# Altium project SpeedGateControl.PrjPcb (part 2 of 2)

## Sheet 06_LED_OUTPUTS.SchDoc
size A3
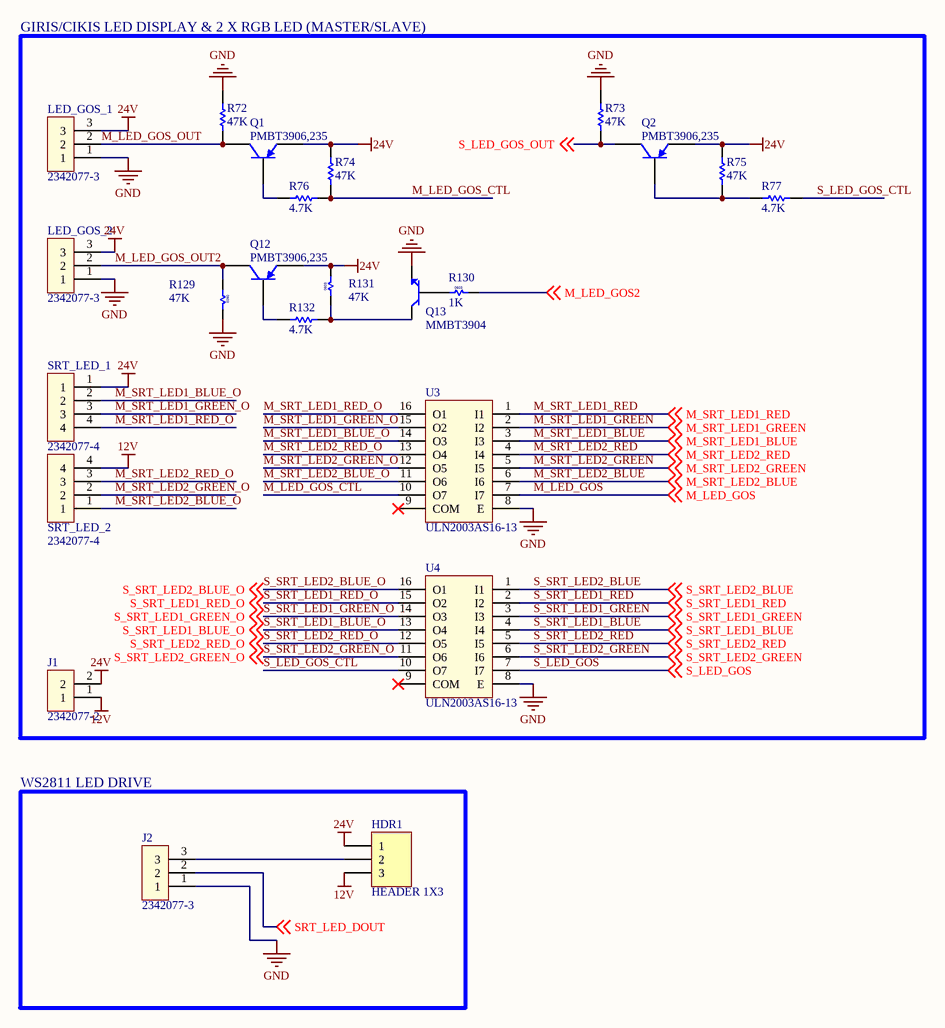
[diagram p5: 06_LED_OUTPUTS.SchDoc]

### Parts
HDR1  HEADER 1X3  [HDR1X3]
J1  2342077-2  [TERM BLOCK HDR 2POS 90DEG PITCH 3.81MM]
J2  2342077-3  [TERM BLOCK HDR 3POS 90DEG PITCH 3.81MM]
LED_GOS_1  2342077-3  [TERM BLOCK HDR 3POS 90DEG PITCH 3.81MM]
LED_GOS_2  2342077-3  [TERM BLOCK HDR 3POS 90DEG PITCH 3.81MM]
Q1  PMBT3906,235  [ONSC-SOT-23-3-318-08_V]
Q2  PMBT3906,235  [ONSC-SOT-23-3-318-08_V]
Q12  PMBT3906,235  [ONSC-SOT-23-3-318-08_V]
Q13  MMBT3904  [ONSC-SOT-23-3-318-08_V]
R72  47K  [603R]
R73  47K  [603R]
R74  47K  [603R]
R75  47K  [603R]
R76  4.7K  [603R]
R77  4.7K  [603R]
R129  47K  [603R]
R130  1K  [603R]
R131  47K  [603R]
R132  4.7K  [603R]
SRT_LED_1  2342077-4  [TERM BLOCK HDR 4POS 90DEG PITCH 3.81MM]
SRT_LED_2  2342077-4  [TERM BLOCK HDR 4POS 90DEG PITCH 3.81MM]
U3  ULN2003AS16-13  [SO16]
U4  ULN2003AS16-13  [SO16]

### Blocks framed on the sheet
GIRIS/CIKIS LED DISPLAY & 2 X RGB LED (MASTER/SLAVE): J1 LED_GOS_1 LED_GOS_2 Q1 Q2 Q12 Q13 R72-R77 R129-R132 SRT_LED_1 SRT_LED_2 U3 U4
WS2811 LED DRIVE: HDR1 J2

### Nets
12V: HDR1.3 J1.1 SRT_LED_2.4
24V: HDR1.1 J1.2 LED_GOS_1.3 LED_GOS_2.3 Q1.2(E) Q2.2(E) Q12.2(E) R74.2 R75.2 R131.2 SRT_LED_1.1
GND: J2.1 LED_GOS_1.1 LED_GOS_2.1 Q13.2(E) R72.1 R73.1 R129.2 U3.8(E) U4.8(E)
M_LED_GOS: U3.7(I7) ; off-sheet M_LED_GOS
M_LED_GOS2: R130.2 ; off-sheet M_LED_GOS2
M_LED_GOS_CTL: R74.1 R76.1 U3.10(O7)
M_LED_GOS_OUT: LED_GOS_1.2 Q1.3(C) R72.2
M_LED_GOS_OUT2: LED_GOS_2.2 Q12.3(C) R129.1
M_SRT_LED1_BLUE: U3.3(I3) ; off-sheet M_SRT_LED1_BLUE
M_SRT_LED1_BLUE_O: SRT_LED_1.2 U3.14(O3)
M_SRT_LED1_GREEN: U3.2(I2) ; off-sheet M_SRT_LED1_GREEN
M_SRT_LED1_GREEN_O: SRT_LED_1.3 U3.15(O2)
M_SRT_LED1_RED: U3.1(I1) ; off-sheet M_SRT_LED1_RED
M_SRT_LED1_RED_O: SRT_LED_1.4 U3.16(O1)
M_SRT_LED2_BLUE: U3.6(I6) ; off-sheet M_SRT_LED2_BLUE
M_SRT_LED2_BLUE_O: SRT_LED_2.1 U3.11(O6)
M_SRT_LED2_GREEN: U3.5(I5) ; off-sheet M_SRT_LED2_GREEN
M_SRT_LED2_GREEN_O: SRT_LED_2.2 U3.12(O5)
M_SRT_LED2_RED: U3.4(I4) ; off-sheet M_SRT_LED2_RED
M_SRT_LED2_RED_O: SRT_LED_2.3 U3.13(O4)
S_LED_GOS: U4.7(I7) ; off-sheet S_LED_GOS
S_LED_GOS_CTL: R77.1 U4.10(O7)
S_LED_GOS_OUT: Q2.3(C) R73.2 ; off-sheet S_LED_GOS_OUT
S_SRT_LED1_BLUE: U4.4(I4) ; off-sheet S_SRT_LED1_BLUE
S_SRT_LED1_BLUE_O: U4.13(O4) ; off-sheet S_SRT_LED1_BLUE_O
S_SRT_LED1_GREEN: U4.3(I3) ; off-sheet S_SRT_LED1_GREEN
S_SRT_LED1_GREEN_O: U4.14(O3) ; off-sheet S_SRT_LED1_GREEN_O
S_SRT_LED1_RED: U4.2(I2) ; off-sheet S_SRT_LED1_RED
S_SRT_LED1_RED_O: U4.15(O2) ; off-sheet S_SRT_LED1_RED_O
S_SRT_LED2_BLUE: U4.1(I1) ; off-sheet S_SRT_LED2_BLUE
S_SRT_LED2_BLUE_O: U4.16(O1) ; off-sheet S_SRT_LED2_BLUE_O
S_SRT_LED2_GREEN: U4.6(I6) ; off-sheet S_SRT_LED2_GREEN
S_SRT_LED2_GREEN_O: U4.11(O6) ; off-sheet S_SRT_LED2_GREEN_O
S_SRT_LED2_RED: U4.5(I5) ; off-sheet S_SRT_LED2_RED
S_SRT_LED2_RED_O: U4.12(O5) ; off-sheet S_SRT_LED2_RED_O
SRT_LED_DOUT: J2.2 ; off-sheet SRT_LED_DOUT
NetHDR1_2: HDR1.2 J2.3
NetQ1_1: Q1.1(B) R76.2
NetQ2_1: Q2.1(B) R75.1 R77.2
NetQ12_1: Q12.1(B) R132.2
NetQ13_1: Q13.1(B) R130.1
NetQ13_3: Q13.3(C) R131.1 R132.1

Not connected (* = marked no-connect by the designer): U3 9(COM)*; U4 9(COM)*

### Notes on the sheet
- (in symbol RES_1K_OHM_%5_0.1W_0603) 0603
- (in symbol RES_47K_OHM_%5_0.1W_0603) 0603

### Library data of the parts
HDR1 = HEADER 1X3: Header, 3-Pin; LatestRevisionDate: 17-Jul-2002; LatestRevisionNote: Re-released for DXP Platform.; Publisher: Altium Limited
J1 = TERM BLOCK HDR 2POS 90DEG 3.81MM: as 24V_IN on sheet 01_POWER; Digi-Key Part Number: A145321-ND; Value: 2342077-2; Pitch: 0.150" (3.81mm); Header Orientation: 90°, Right Angle; Insulation Height: 0.285" (7.25mm)
J2 LED_GOS_1 LED_GOS_2 = TERM BLOCK HDR 3POS 90DEG 3.81MM: 3 Position Terminal Block Header, Male Pins, Shrouded (4 Side) 0.150" (3.81mm) 90°, Right Angle - Through Hole; Manufacturer: TE Connectivity AMP Connectors; Contact Tail Length: 0.075" (1.90mm); Digi-Key Part Number: A145322-ND; Value: 2342077-3; Pitch: 0.150" (3.81mm); Header Orientation: 90°, Right Angle; Insulation Height: 0.285" (7.25mm)
Q1 Q2 Q12 = TRANS PNP 40V 200MA TO236AB PMBT3906_235: Bipolar (BJT) Transistor PNP 40 V 200 mA 250MHz 250 mW Surface Mount TO-236AB; DC Current Gain (hFE) (Min) @ Ic, Vce: 100 @ 10mA, 1V; Power - Max: 250 mW; Vce Saturation (Max) @ Ib, Ic: 400mV @ 5mA, 50mA; Voltage - Collector Emitter Breakdown (Max): 40 V; Current - Collector (Ic) (Max): 200 mA; Package / Case: TO-236-3, SC-59, SOT-23-3; Operating Temperature: 150°C (TJ); Transistor Type: PNP; Value: PMBT3906,235; Digi-Key Part Number: 1727-1885-1-ND
Q13 = NPN_BT3904: Bipolar (BJT) Transistor NPN 40V 200mA 300MHz 300mW Surface Mount SOT-23-3 (TO-236); Manufacturer: ON Semiconductor; Manufacturer Part Number: MMBT3904LT3G; MAX  Voltage / Current: 40V /200mA; DC Current Gain (hFE) (Min) @ Ic, Vce: 100 @ 10mA, 1V; Vce Saturation (Max) @ Ib, Ic: 300mV @ 5mA, 50mA; value: MMBT3904; Digi-Key Part Number: MMBT3904LT3GOSTR-ND; Package / Case: TO-236-3, SC-59, SOT-23-3; Power - Max: 300mW; Frequency - Transition: 300MHz; Transistor Type: NPN; Current - Collector (Ic) (Max): 200mA; Voltage - Collector Emitter Breakdown (Max): 40V; Operating Temperature: -55°C ~ 150°C (TJ); Supplier Device Package: SOT-23-3 (TO-236)
R72-R75 = RES SMD 47K OHM 1% 1/10W 0603: 47 kOhms ±1% 0.1W, 1/10W Chip Resistor 0603 (1608 Metric)  Thick Film; Manufacturer: Yageo; Manufacturer Part Number: RC0603FR-0747KL; Temperature Coefficient: ±100ppm/°C; Value: 47K; Digi-Key Part Number: 311-47.0KHRCT-ND; Tolerance: ±1%; Power (Watts): 0.1W, 1/10W; Composition: Thick Film; Operating Temperature: -55°C ~ 155°C; Package / Case: 0603 (1608 Metric); Size / Dimension: 0.063" L x 0.032" W (1.60mm x 0.80mm); Height - Seated (Max): 0.022" (0.55mm)
R76 R77 R132 = RES_4.7K_OHM_%5_0.1W_0603: as R6 on sheet 03_PHOTOELECTRIC_SENSOR; Value: 4.7K; Digi-Key Part Number: 311-4.7KGRTR-ND; Tolerance: ±5%; Power (Watts): 0.1W, 1/10W; Composition: Thick Film; Operating Temperature: -55°C ~ 155°C; Package / Case: 0603 (1608 Metric); Size / Dimension: 0.063" L x 0.032" W (1.60mm x 0.80mm); Height - Seated (Max): 0.022" (0.55mm); Features: Moisture Resistant
R129 R131 = RES_47K_OHM_%5_0.1W_0603: 47 kOhms ±5% 0.1W, 1/10W Chip Resistor 0603 (1608 Metric) Moisture Resistant Thick Film; Manufacturer: Yageo; Manufacturer Part Number: RC0603JR-0747KL; Temperature Coefficient: ±100ppm/°C; Value: 47K; Digi-Key Part Number: 311-47KGRTR-ND; Tolerance: ±5%; Power (Watts): 0.1W, 1/10W; Composition: Thick Film; Operating Temperature: -55°C ~ 155°C; Package / Case: 0603 (1608 Metric); Size / Dimension: 0.063" L x 0.032" W (1.60mm x 0.80mm); Height - Seated (Max): 0.022" (0.55mm); Features: Moisture Resistant
R130 = RES_1K_OHM_%5_0.1W_0603: 1 kOhms ±5% 0.1W, 1/10W Chip Resistor 0603 (1608 Metric) Moisture Resistant Thick Film; Manufacturer: Yageo; Manufacturer Part Number: RC0603JR-071KL; Temperature Coefficient: ±100ppm/°C; Value: 1K; Digi-Key Part Number: 311-1.0KGRTR-ND; Tolerance: ±5%; Power (Watts): 0.1W, 1/10W; Composition: Thick Film; Operating Temperature: -55°C ~ 155°C; Package / Case: 0603 (1608 Metric); Size / Dimension: 0.063" L x 0.032" W (1.60mm x 0.80mm); Height - Seated (Max): 0.022" (0.55mm); Features: Moisture Resistant
SRT_LED_1 SRT_LED_2 = TERM BLOCK HDR 4POS 90DEG 3.81MM: 4 Position Terminal Block Header, Male Pins, Shrouded (4 Side) 0.150" (3.81mm) 90°, Right Angle - Through Hole; Manufacturer: TE Connectivity AMP Connectors; Contact Tail Length: 0.075" (1.90mm); Digi-Key Part Number: A145323-ND; Value: 2342077-4; Pitch: 0.150" (3.81mm); Header Orientation: 90°, Right Angle; Insulation Height: 0.285" (7.25mm)
U3 U4 = IC PWR RELAY 7NPN 1:1 16SO ULN2003AS16-13: Bipolar (BJT) Transistor Array 7 NPN Darlington 50V 500mA - - Surface Mount 16-SO; Manufacturer: Diodes Incorporated; Current - Supply: 285µA; Vce Saturation (Max) @ Ib, Ic: 1.6V @ 500µA, 350mA; Digi-Key Part Number: ULN2003AS16-13DICT-ND; Value: ULN2003AS16-13; Operating Temperature: -40°C ~ 105°C (TA); Transistor Type: 7 NPN Darlington; Current - Collector (Ic) (Max): 500mA; Package / Case: 16-SOIC (0.154", 3.90mm Width); Voltage - Collector Emitter Breakdown (Max): 50V

## Sheet 07_MOTOR_DRIVER_INTERFACE.SchDoc
size A4
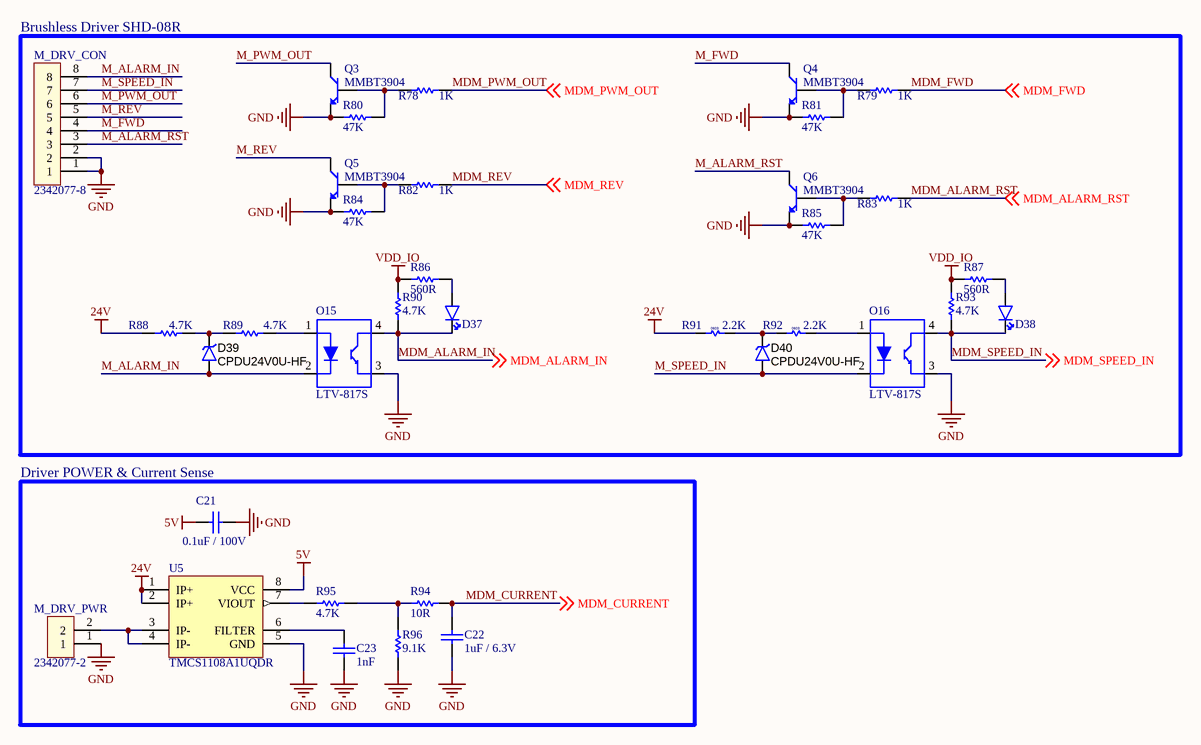
[diagram p6: 07_MOTOR_DRIVER_INTERFACE.SchDoc]

### Parts
C21  0.1uF / 100V  [603C]
C22  1uF / 6.3V  [603C]
C23  1nF  [603C]
D37  led_green  [805LED]  (value not drawn)
D38  led_green  [805LED]  (value not drawn)
D39  CPDU24V0U-HF  [SOD523F]
D40  CPDU24V0U-HF  [SOD523F]
M_DRV_CON  2342077-8  [TERM BLOCK HDR 8POS 90DEG PITCH 3.81MM]
M_DRV_PWR  2342077-2  [TERM BLOCK HDR 2POS 90DEG PITCH 3.81MM]
O15  LTV-817S  [SMD4-2.54-4.6X6.5MM]
O16  LTV-817S  [SMD4-2.54-4.6X6.5MM]
Q3  MMBT3904  [ONSC-SOT-23-3-318-08_V]
Q4  MMBT3904  [ONSC-SOT-23-3-318-08_V]
Q5  MMBT3904  [ONSC-SOT-23-3-318-08_V]
Q6  MMBT3904  [ONSC-SOT-23-3-318-08_V]
R78  1K  [603R]
R79  1K  [603R]
R80  47K  [603R]
R81  47K  [603R]
R82  1K  [603R]
R83  1K  [603R]
R84  47K  [603R]
R85  47K  [603R]
R86  560R  [603R]
R87  560R  [603R]
R88  4.7K  [603R]
R89  4.7K  [603R]
R90  4.7K  [603R]
R91  2.2K  [603R]
R92  2.2K  [603R]
R93  4.7K  [603R]
R94  10R  [603R]
R95  4.7K  [603R]
R96  9.1K  [603R]
U5  TMCS1108A1UQDR  [ACS712]

### Blocks framed on the sheet
Brushless Driver SHD-08R: D37-D40 M_DRV_CON O15 O16 Q3-Q6 R78-R93
Driver POWER & Current Sense: C21-C23 M_DRV_PWR R94-R96 U5

### Nets
5V: C21.1 R86.2 R87.2 R90.2 R93.2 U5.8(VCC)  [also labelled VDD_IO]
24V: R88.1 R91.1 U5.1(IP+) U5.2(IP+)
GND: C21.2 C22.1 C23.1 M_DRV_CON.1 M_DRV_CON.2 M_DRV_PWR.1 O15.3(EMITER) O16.3(EMITER) Q3.2(E) Q4.2(E) Q5.2(E) Q6.2(E) R80.1 R81.1 R84.1 R85.1 R96.1 U5.5(GND)
M_ALARM_IN: D39.1 M_DRV_CON.8 O15.2(CATHODE)
M_ALARM_RST: M_DRV_CON.3 Q6.3(C)
M_FWD: M_DRV_CON.4 Q4.3(C)
M_PWM_OUT: M_DRV_CON.6 Q3.3(C)
M_REV: M_DRV_CON.5 Q5.3(C)
M_SPEED_IN: D40.1 M_DRV_CON.7 O16.2(CATHODE)
MDM_ALARM_IN: D37.2(K) O15.4(COLLECTOR) R90.1 ; off-sheet MDM_ALARM_IN
MDM_ALARM_RST: R83.2 ; off-sheet MDM_ALARM_RST
MDM_CURRENT: C22.2 R94.2 ; off-sheet MDM_CURRENT
MDM_FWD: R79.2 ; off-sheet MDM_FWD
MDM_PWM_OUT: R78.2 ; off-sheet MDM_PWM_OUT
MDM_REV: R82.2 ; off-sheet MDM_REV
MDM_SPEED_IN: D38.2(K) O16.4(COLLECTOR) R93.1 ; off-sheet MDM_SPEED_IN
NetC23_2: C23.2 U5.6(FILTER)
NetD37_1: D37.1(A) R86.1
NetD38_1: D38.1(A) R87.1
NetD39_2: D39.2 R88.2 R89.1
NetD40_2: D40.2 R91.2 R92.1
NetM_DRV_PWR_2: M_DRV_PWR.2 U5.3(IP-) U5.4(IP-)
NetO15_1: O15.1(ANODE) R89.2
NetO16_1: O16.1(ANODE) R92.2
NetQ3_1: Q3.1(B) R78.1 R80.2
NetQ4_1: Q4.1(B) R79.1 R81.2
NetQ5_1: Q5.1(B) R82.1 R84.2
NetQ6_1: Q6.1(B) R83.1 R85.2
NetR94_1: R94.1 R95.1 R96.2
NetR95_2: R95.2 U5.7(VIOUT)

### Notes on the sheet
- (in symbol RES 2.2K OHM 5% 1/10W 0603) 0603

### Library data of the parts
C21 = CAP CER 0.1UF 100V X7R 0603: as C4 on sheet 01_POWER; Value: 0.1uF / 100V; Digi-Key Part Number: 2679-C0603X7R101-104KNPTR-ND; Tolerance: ±10%; Voltage - Rated: 100V; Temperature Coefficient: X7R; Operating Temperature: -55°C ~ 125°C; Applications: General Purpose; Package / Case: 0603 (1608 Metric)
C22 = CAP_CER 1UF 6.3V X5R 0603: 1µF ±10% 6.3V Ceramic Capacitor X5R 0603 (1608 Metric); Manufacturer: Samsung Electro-Mechanics; Manufacturer Part Number: CL10A105KQ8NNNC; Value: 1uF / 6.3V; Digi-Key Part Number: 1276-1036-1-ND; Tolerance: ±10%; Voltage - Rated: 6.3V; Temperature Coefficient: X5R; Operating Temperature: -55°C ~ 85°C; Applications: General Purpose; Package / Case: 0603 (1608 Metric)
C23 = CAP_CER_1nF_50V_%5_ X7R_ 0603: 1nF ±5% 50V Ceramic Capacitor X7R 0603 (1608 Metric); Manufacturer: Yageo; Manufacturer Part Number: CC0603JRX7R9BB102; Value: 1nF; Digi-Key Part Number: 311-3361-2-ND; Tolerance: ±5%; Voltage - Rated: 50V; Temperature Coefficient: X7R; Operating Temperature: -55°C ~ 125°C; Applications: General Purpose; Package / Case: 0603 (1608 Metric); Size / Dimension: 0.063" L x 0.032" W (1.60mm x 0.80mm); Thickness (Max): 0.035" (0.90mm)
D37 D38 = LED_GREEN_0805: as D46 on sheet 02_CPU; value: led_green; Digi-Key Part Number: 754-1127-1-ND; Case: 0805; Viewing Angle: -
D39 D40 = TVS DIODE 24VWM 50V 0603/SOD523F CPDU24V0U-HF: 50V Clamp 3A (8/20µs) Ipp Tvs Diode Surface Mount 0603/SOD-523F; Manufacturer: Comchip Technology; Type: Zener; Voltage - Reverse Standoff (Typ): 24V (Max); Voltage - Breakdown (Min): 26.5V; Power - Peak Pulse: 150W; Power Line Protection: No; Unidirectional Channels: 1; Digi-Key Part Number: 641-1679-1-ND; Manufacturer Part Number: CPDU24V0U-HF; Voltage - Clamping (Max) @ Ipp: 50V; Operating Temperature: -55°C ~ 125°C (TJ); Package / Case: 0603/SOD-523F; Value: CPDU24V0U-HF
M_DRV_CON = TERM BLOCK HDR 8POS 90DEG 3.81MM: 8 Position Terminal Block Header, Male Pins, Shrouded (4 Side) 0.150" (3.81mm) 90°, Right Angle - Through Hole; Manufacturer: TE Connectivity AMP Connectors; Contact Tail Length: 0.075" (1.90mm); Digi-Key Part Number: A145326-ND; Value: 2342077-8; Pitch: 0.150" (3.81mm); Header Orientation: 90°, Right Angle; Insulation Height: 0.285" (7.25mm)
M_DRV_PWR = TERM BLOCK HDR 2POS 90DEG 3.81MM: as 24V_IN on sheet 01_POWER; Digi-Key Part Number: A145321-ND; Value: 2342077-2; Pitch: 0.150" (3.81mm); Header Orientation: 90°, Right Angle; Insulation Height: 0.285" (7.25mm)
O15 O16 = OPTOISOLATR 5KV TRANSISTOR 4-SMD LTV-817S: Optoisolator Transistor Output 5000Vrms 1 Channel 4-SMD; Voltage - Output (Max): 35V; Number of Channels: 1; Rise / Fall Time (Typ): 4µs, 3µs; Current - DC Forward (If) (Max): 50 mA; Voltage - Forward (Vf) (Typ): 1.2V; Output Type: Transistor; Voltage - Isolation: 5000Vrms; Package / Case: 4-SMD, Gull Wing; Operating Temperature: -30°C ~ 110°C; Value: LTV-817S; Digi-Key Part Number: 160-1367-5-ND
Q3-Q6 = NPN_BT3904: as Q13 on sheet 06_LED_OUTPUTS; value: MMBT3904; Digi-Key Part Number: MMBT3904LT3GOSTR-ND; Package / Case: TO-236-3, SC-59, SOT-23-3; Power - Max: 300mW; Frequency - Transition: 300MHz; Transistor Type: NPN; Current - Collector (Ic) (Max): 200mA; Voltage - Collector Emitter Breakdown (Max): 40V; Operating Temperature: -55°C ~ 150°C (TJ); Supplier Device Package: SOT-23-3 (TO-236)
R78 R79 R82 R83 = RES_1K_OHM_%5_0.1W_0603: as R130 on sheet 06_LED_OUTPUTS; Value: 1K; Digi-Key Part Number: 311-1.0KGRTR-ND; Tolerance: ±5%; Power (Watts): 0.1W, 1/10W; Composition: Thick Film; Operating Temperature: -55°C ~ 155°C; Package / Case: 0603 (1608 Metric); Size / Dimension: 0.063" L x 0.032" W (1.60mm x 0.80mm); Height - Seated (Max): 0.022" (0.55mm); Features: Moisture Resistant
R80 R81 R84 R85 = RES_47K_OHM_%5_0.1W_0603: as R129 on sheet 06_LED_OUTPUTS; Value: 47K; Digi-Key Part Number: 311-47KGRTR-ND; Tolerance: ±5%; Power (Watts): 0.1W, 1/10W; Composition: Thick Film; Operating Temperature: -55°C ~ 155°C; Package / Case: 0603 (1608 Metric); Size / Dimension: 0.063" L x 0.032" W (1.60mm x 0.80mm); Height - Seated (Max): 0.022" (0.55mm); Features: Moisture Resistant
R86 R87 = RES_560_OHM_%5_0.1W_0603: as R128 on sheet 02_CPU; Value: 560R; Digi-Key Part Number: 311-560GRCT-ND; Tolerance: ±5%; Power (Watts): 0.1W, 1/10W; Composition: Thick Film; Operating Temperature: -55°C ~ 155°C; Package / Case: 0603 (1608 Metric); Size / Dimension: 0.063" L x 0.032" W (1.60mm x 0.80mm); Height - Seated (Max): 0.022" (0.55mm); Features: Moisture Resistant
R88-R90 R93 = RES_4.7K_OHM_%5_0.1W_0603: as R6 on sheet 03_PHOTOELECTRIC_SENSOR; Value: 4.7K; Digi-Key Part Number: 311-4.7KGRTR-ND; Tolerance: ±5%; Power (Watts): 0.1W, 1/10W; Composition: Thick Film; Operating Temperature: -55°C ~ 155°C; Package / Case: 0603 (1608 Metric); Size / Dimension: 0.063" L x 0.032" W (1.60mm x 0.80mm); Height - Seated (Max): 0.022" (0.55mm); Features: Moisture Resistant
R91 R92 = RES 2.2K OHM 5% 1/10W 0603: 2.2 kOhms ±5% 0.1W, 1/10W Chip Resistor 0603 (1608 Metric) Automotive AEC-Q200 Thick Film; Temperature Coefficient: ±200ppm/°C; Value: 2.2K; Digi-Key Part Number: RMCF0603JT2K20TR-ND; Tolerance: ±5%; Power (Watts): 0.1W, 1/10W; Operating Temperature: -55°C ~ 155°C; Package / Case: 0603 (1608 Metric)
R94 = RES_10_OHM_%1_0.1W_0603: 10 Ohms ±1% 0.1W, 1/10W Chip Resistor 0603 (1608 Metric) Moisture Resistant Thick Film; Manufacturer: Yageo; Manufacturer Part Number: RC0603FR-0710RL; Temperature Coefficient: ±100ppm/°C; Value: 10R; Digi-Key Part Number: 311-10.0HRCT-ND; Tolerance: ±1%; Power (Watts): 0.1W, 1/10W; Composition: Thick Film; Operating Temperature: -55°C ~ 155°C; Package / Case: 0603 (1608 Metric); Size / Dimension: 0.063" L x 0.032" W (1.60mm x 0.80mm); Height - Seated (Max): 0.022" (0.55mm); Features: Moisture Resistant
R95 = RES SMD 4.7K OHM 1% 1/10W 0603: 4.7 kOhms ±1% 0.1W, 1/10W Chip Resistor 0603 (1608 Metric)  Thick Film; Temperature Coefficient: ±100ppm/°C; Value: 4.7K; Digi-Key Part Number: 311-4.70KHRCT-ND; Tolerance: ±1%; Power (Watts): 0.1W, 1/10W; Operating Temperature: -55°C ~ 155°C; Package / Case: 0603 (1608 Metric)
R96 = RES 9.1K OHM 5% 1/10W 0603: 9.1 kOhms ±5% 0.1W, 1/10W Chip Resistor 0603 (1608 Metric) Moisture Resistant Thick Film; Manufacturer: Yageo; Manufacturer Part Number: RC0603JR-079K1L; Temperature Coefficient: ±100ppm/°C; Value: 9.1K; Digi-Key Part Number: 311-9.1KGRCT-ND; Tolerance: ±5%; Power (Watts): 0.1W, 1/10W; Composition: Thick Film; Operating Temperature: -55°C ~ 155°C; Package / Case: 0603 (1608 Metric); Size / Dimension: 0.063" L x 0.032" W (1.60mm x 0.80mm); Height - Seated (Max): 0.022" (0.55mm); Features: Moisture Resistant
U5 = 100-V HALL-EFFECT CURRENT SENSOR TMCS1108A1UQDR: Current Sensor - 1 Channel Hall Effect Unidirectional 8-SOIC (0.154", 3.90mm Width); Manufacturer: Texas Instruments; For Measuring: DC; Current - Sensing (3V ~5V): 30 ~50A; Voltage - Supply: 3V ~ 5.5V; Frequency: DC ~ 80kHz; Sensitivity: 50mV/A; Output: Ratiometric, Voltage; Digi-Key Part Number: 296-TMCS1108A1UQDRCT-ND; Sensor Type: Hall Effect; Operating Temperature: -40°C ~ 125°C (TA); Package / Case: 8-SOIC (0.154", 3.90mm Width); Polarization: Unidirectional; Manufacturer Part Number: TMCS1108A1UQDR; Value: TMCS1108A1UQDR

## Sheet 08_SLAVE_CARD_CONNECTOR_RJ45.SchDoc
size A3
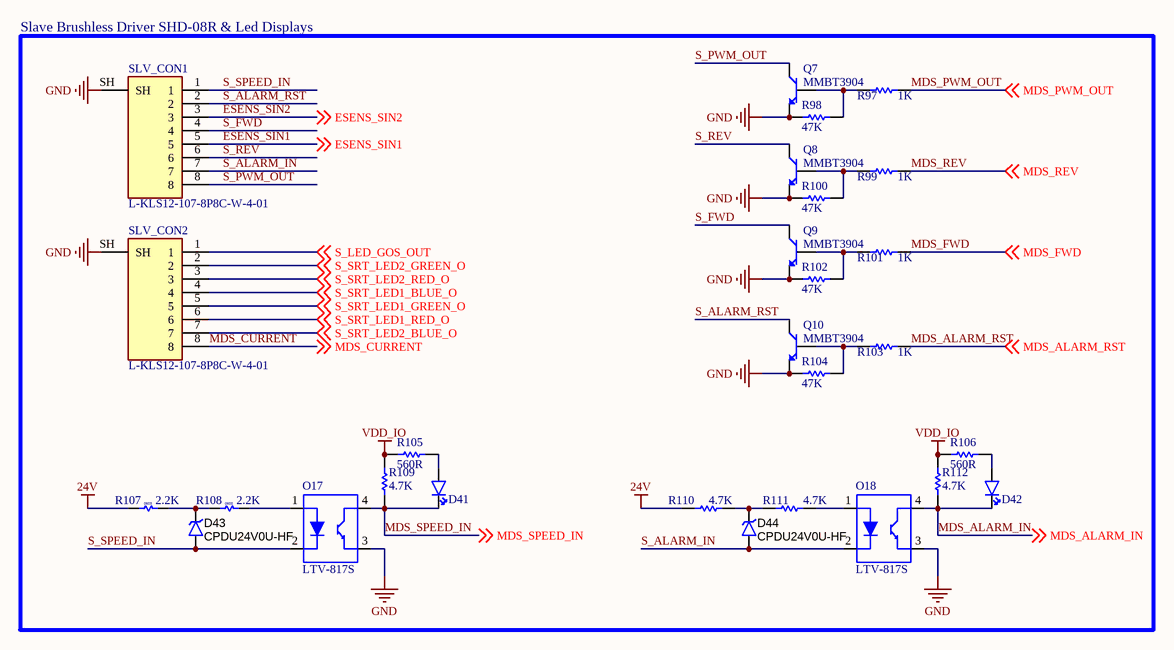
[diagram p7: 08_SLAVE_CARD_CONNECTOR_RJ45.SchDoc]

### Parts
D41  led_green  [805LED]  (value not drawn)
D42  led_green  [805LED]  (value not drawn)
D43  CPDU24V0U-HF  [SOD523F]
D44  CPDU24V0U-HF  [SOD523F]
O17  LTV-817S  [SMD4-2.54-4.6X6.5MM]
O18  LTV-817S  [SMD4-2.54-4.6X6.5MM]
Q7  MMBT3904  [ONSC-SOT-23-3-318-08_V]
Q8  MMBT3904  [ONSC-SOT-23-3-318-08_V]
Q9  MMBT3904  [ONSC-SOT-23-3-318-08_V]
Q10  MMBT3904  [ONSC-SOT-23-3-318-08_V]
R97  1K  [603R]
R98  47K  [603R]
R99  1K  [603R]
R100  47K  [603R]
R101  1K  [603R]
R102  47K  [603R]
R103  1K  [603R]
R104  47K  [603R]
R105  560R  [603R]
R106  560R  [603R]
R107  2.2K  [603R]
R108  2.2K  [603R]
R109  4.7K  [603R]
R110  4.7K  [603R]
R111  4.7K  [603R]
R112  4.7K  [603R]
SLV_CON1  L-KLS12-107-8P8C-W-4-01  [RJ45_JACK_H L-KLS12-107-8P8C-W-4-01]
SLV_CON2  L-KLS12-107-8P8C-W-4-01  [RJ45_JACK_H L-KLS12-107-8P8C-W-4-01]

### Blocks framed on the sheet
Slave Brushless Driver SHD-08R & Led Displays: D41-D44 O17 O18 Q7-Q10 R97-R112 SLV_CON1 SLV_CON2

### Nets
24V: R107.1 R110.1
GND: O17.3(EMITER) O18.3(EMITER) Q7.2(E) Q8.2(E) Q9.2(E) Q10.2(E) R98.1 R100.1 R102.1 R104.1 SLV_CON1.SH SLV_CON2.SH
VDD_IO: R105.2 R106.2 R109.2 R112.2  [project net 5V]
ESENS_SIN1: SLV_CON1.5 ; off-sheet ESENS_SIN1
ESENS_SIN2: SLV_CON1.3 ; off-sheet ESENS_SIN2
MDS_ALARM_IN: D42.2(K) O18.4(COLLECTOR) R112.1 ; off-sheet MDS_ALARM_IN
MDS_ALARM_RST: R103.2 ; off-sheet MDS_ALARM_RST
MDS_CURRENT: SLV_CON2.8 ; off-sheet MDS_CURRENT
MDS_FWD: R101.2 ; off-sheet MDS_FWD
MDS_PWM_OUT: R97.2 ; off-sheet MDS_PWM_OUT
MDS_REV: R99.2 ; off-sheet MDS_REV
MDS_SPEED_IN: D41.2(K) O17.4(COLLECTOR) R109.1 ; off-sheet MDS_SPEED_IN
S_ALARM_IN: D44.1 O18.2(CATHODE) SLV_CON1.7
S_ALARM_RST: Q10.3(C) SLV_CON1.2
S_FWD: Q9.3(C) SLV_CON1.4
S_LED_GOS_OUT: SLV_CON2.1 ; off-sheet S_LED_GOS_OUT
S_PWM_OUT: Q7.3(C) SLV_CON1.8
S_REV: Q8.3(C) SLV_CON1.6
S_SPEED_IN: D43.1 O17.2(CATHODE) SLV_CON1.1
S_SRT_LED1_BLUE_O: SLV_CON2.4 ; off-sheet S_SRT_LED1_BLUE_O
S_SRT_LED1_GREEN_O: SLV_CON2.5 ; off-sheet S_SRT_LED1_GREEN_O
S_SRT_LED1_RED_O: SLV_CON2.6 ; off-sheet S_SRT_LED1_RED_O
S_SRT_LED2_BLUE_O: SLV_CON2.7 ; off-sheet S_SRT_LED2_BLUE_O
S_SRT_LED2_GREEN_O: SLV_CON2.2 ; off-sheet S_SRT_LED2_GREEN_O
S_SRT_LED2_RED_O: SLV_CON2.3 ; off-sheet S_SRT_LED2_RED_O
NetD41_1: D41.1(A) R105.1
NetD42_1: D42.1(A) R106.1
NetD43_2: D43.2 R107.2 R108.1
NetD44_2: D44.2 R110.2 R111.1
NetO17_1: O17.1(ANODE) R108.2
NetO18_1: O18.1(ANODE) R111.2
NetQ7_1: Q7.1(B) R97.1 R98.2
NetQ8_1: Q8.1(B) R99.1 R100.2
NetQ9_1: Q9.1(B) R101.1 R102.2
NetQ10_1: Q10.1(B) R103.1 R104.2

### Notes on the sheet
- (in symbol RES 2.2K OHM 5% 1/10W 0603) 0603

### Library data of the parts
D41 D42 = LED_GREEN_0805: as D46 on sheet 02_CPU; value: led_green; Digi-Key Part Number: 754-1127-1-ND; Case: 0805; Viewing Angle: -
D43 D44 = TVS DIODE 24VWM 50V 0603/SOD523F CPDU24V0U-HF: as D39 on sheet 07_MOTOR_DRIVER_INTERFACE; Digi-Key Part Number: 641-1679-1-ND; Manufacturer Part Number: CPDU24V0U-HF; Voltage - Clamping (Max) @ Ipp: 50V; Operating Temperature: -55°C ~ 125°C (TJ); Package / Case: 0603/SOD-523F; Value: CPDU24V0U-HF
O17 O18 = OPTOISOLATR 5KV TRANSISTOR 4-SMD LTV-817S: as O15 on sheet 07_MOTOR_DRIVER_INTERFACE; Output Type: Transistor; Voltage - Isolation: 5000Vrms; Package / Case: 4-SMD, Gull Wing; Operating Temperature: -30°C ~ 110°C; Value: LTV-817S; Digi-Key Part Number: 160-1367-5-ND
Q7-Q10 = NPN_BT3904: as Q13 on sheet 06_LED_OUTPUTS; value: MMBT3904; Digi-Key Part Number: MMBT3904LT3GOSTR-ND; Package / Case: TO-236-3, SC-59, SOT-23-3; Power - Max: 300mW; Frequency - Transition: 300MHz; Transistor Type: NPN; Current - Collector (Ic) (Max): 200mA; Voltage - Collector Emitter Breakdown (Max): 40V; Operating Temperature: -55°C ~ 150°C (TJ); Supplier Device Package: SOT-23-3 (TO-236)
R97 R99 R101 R103 = RES_1K_OHM_%5_0.1W_0603: as R130 on sheet 06_LED_OUTPUTS; Value: 1K; Digi-Key Part Number: 311-1.0KGRTR-ND; Tolerance: ±5%; Power (Watts): 0.1W, 1/10W; Composition: Thick Film; Operating Temperature: -55°C ~ 155°C; Package / Case: 0603 (1608 Metric); Size / Dimension: 0.063" L x 0.032" W (1.60mm x 0.80mm); Height - Seated (Max): 0.022" (0.55mm); Features: Moisture Resistant
R98 R100 R102 R104 = RES_47K_OHM_%5_0.1W_0603: as R129 on sheet 06_LED_OUTPUTS; Value: 47K; Digi-Key Part Number: 311-47KGRTR-ND; Tolerance: ±5%; Power (Watts): 0.1W, 1/10W; Composition: Thick Film; Operating Temperature: -55°C ~ 155°C; Package / Case: 0603 (1608 Metric); Size / Dimension: 0.063" L x 0.032" W (1.60mm x 0.80mm); Height - Seated (Max): 0.022" (0.55mm); Features: Moisture Resistant
R105 R106 = RES_560_OHM_%5_0.1W_0603: as R128 on sheet 02_CPU; Value: 560R; Digi-Key Part Number: 311-560GRCT-ND; Tolerance: ±5%; Power (Watts): 0.1W, 1/10W; Composition: Thick Film; Operating Temperature: -55°C ~ 155°C; Package / Case: 0603 (1608 Metric); Size / Dimension: 0.063" L x 0.032" W (1.60mm x 0.80mm); Height - Seated (Max): 0.022" (0.55mm); Features: Moisture Resistant
R107 R108 = RES 2.2K OHM 5% 1/10W 0603: as R91 on sheet 07_MOTOR_DRIVER_INTERFACE; Value: 2.2K; Digi-Key Part Number: RMCF0603JT2K20TR-ND; Tolerance: ±5%; Power (Watts): 0.1W, 1/10W; Operating Temperature: -55°C ~ 155°C; Package / Case: 0603 (1608 Metric)
R109-R112 = RES_4.7K_OHM_%5_0.1W_0603: as R6 on sheet 03_PHOTOELECTRIC_SENSOR; Value: 4.7K; Digi-Key Part Number: 311-4.7KGRTR-ND; Tolerance: ±5%; Power (Watts): 0.1W, 1/10W; Composition: Thick Film; Operating Temperature: -55°C ~ 155°C; Package / Case: 0603 (1608 Metric); Size / Dimension: 0.063" L x 0.032" W (1.60mm x 0.80mm); Height - Seated (Max): 0.022" (0.55mm); Features: Moisture Resistant
SLV_CON1 SLV_CON2 = MODULAR JACK THT R/A 8P8C (RJ45,Ethernet) BLACK L-KLS12-107-8P8C-W-4-01: Jack Modular Connector 8p8c (RJ45, Ethernet) 90° Angle (Right) Shielded; Digi-Key Part Number: https://ozdisan.com/konnektor-ve-baglanti-elemanlari/moduler-konnektorler/moduler-jackler/L-KLS12-107-8P8C-W-4-01/507086; Value: L-KLS12-107-8P8C-W-4-01; Number of Positions/Contacts: 8P8C; Orientation: 90° Angle  (Right); Shielding: Shielded

## Sheet 09_RS232.SchDoc
size A3
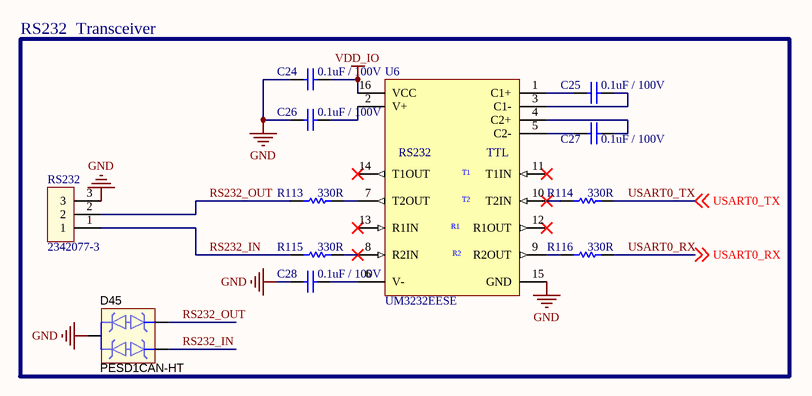
[diagram p8: 09_RS232.SchDoc]

### Parts
C24  0.1uF / 100V  [603C]
C25  0.1uF / 100V  [603C]
C26  0.1uF / 100V  [603C]
C27  0.1uF / 100V  [603C]
C28  0.1uF / 100V  [603C]
D45  PESD1CAN-HT  [ONSC-SOT-23-3-318-08_V]
R113  330R  [603R]
R114  330R  [603R]
R115  330R  [603R]
R116  330R  [603R]
RS232  2342077-3  [TERM BLOCK HDR 3POS 90DEG PITCH 3.81MM]
U6  UM3232EESE  [SOIC127P600X175-16N]

### Blocks framed on the sheet
RS232  Transceiver: C24-C28 D45 R113-R116 RS232 U6

### Nets
GND: C24.1 C26.1 C28.1 D45.3 RS232.3 U6.15(GND)
VDD_IO: C24.2 U6.16(VCC)  [project net 5V]
RS232_IN: D45.1 R115.2 RS232.1
RS232_OUT: D45.2 R113.1 RS232.2
USART0_RX: R116.1 ; off-sheet USART0_RX
USART0_TX: R114.2 ; off-sheet USART0_TX
NetC25_1: C25.1 U6.1(C1+)
NetC25_2: C25.2 U6.3(C1-)
NetC26_2: C26.2 U6.2(V+)
NetC27_1: C27.1 U6.5(C2-)
NetC27_2: C27.2 U6.4(C2+)
NetC28_2: C28.2 U6.6(V-)
NetR113_2: R113.2 U6.7(T2OUT)
NetR114_1: R114.1 U6.10(T2IN)
NetR115_1: R115.1 U6.8(R2IN)
NetR116_2: R116.2 U6.9(R2OUT)

Not connected (* = marked no-connect by the designer): U6 11(T1IN)* 12(R1OUT)* 13(R1IN)* 14(T1OUT)*

### Notes on the sheet
- (in symbol IC TRANSCEIVER FULL 2/2 16SOIC 3.90mm Width) RS232; TTL; T1; T2; R1; R2

### Library data of the parts
C24-C28 = CAP CER 0.1UF 100V X7R 0603: as C4 on sheet 01_POWER; Value: 0.1uF / 100V; Digi-Key Part Number: 2679-C0603X7R101-104KNPTR-ND; Tolerance: ±10%; Voltage - Rated: 100V; Temperature Coefficient: X7R; Operating Temperature: -55°C ~ 125°C; Applications: General Purpose; Package / Case: 0603 (1608 Metric)
D45 = TVS DIODE 24V 40VC SOT23-3 PESD1CAN-HT: 24V, 40V Clamp 3A (8/20µs) Ipp Tvs Diode Surface Mount SOT-23-3; Manufacturer: Hottech; Type: Zener; Voltage - Breakdown (Min): 25.4V; Power - Peak Pulse: 200W; Power Line Protection: No; Capacitance @ Frequency: 17pF @ 1MHz; Bidirectional Channels: 2; Digi-Key Part Number: https://www.ozdisan.com/guc-yari-iletkenleri/diyotlar-modul-diyotlar-ve-dogrultucular/tvs-diyotlar/PESD1CAN-HT; Manufacturer Part Number: PESD1CAN-HT; Voltage - Reverse Standoff (Typ): 24V; Voltage - Clamping (Max) @ Ipp: 40V; Current - Peak Pulse (10/1000µs): 3A (8/20µs); Operating Temperature: -50°C ~ 125°C (TJ); Package / Case: TO-236-3, SC-59, SOT-23-3; Value: PESD1CAN-HT; Applications: RS-232
R113-R116 = RES_330_OHM_%5_0.1W_0603: 330 Ohms ±5% 0.1W, 1/10W Chip Resistor 0603 (1608 Metric) Moisture Resistant Thick Film; Manufacturer: Yageo; Manufacturer Part Number: RC0603JR-07330RL; Temperature Coefficient: ±100ppm/°C; Value: 330R; Digi-Key Part Number: 311-330GRTR-ND; Tolerance: ±5%; Power (Watts): 0.1W, 1/10W; Composition: Thick Film; Operating Temperature: -55°C ~ 155°C; Package / Case: 0603 (1608 Metric); Size / Dimension: 0.063" L x 0.032" W (1.60mm x 0.80mm); Height - Seated (Max): 0.022" (0.55mm); Features: Moisture Resistant
RS232 = TERM BLOCK HDR 3POS 90DEG 3.81MM: as J2 on sheet 06_LED_OUTPUTS; Digi-Key Part Number: A145322-ND; Value: 2342077-3; Pitch: 0.150" (3.81mm); Header Orientation: 90°, Right Angle; Insulation Height: 0.285" (7.25mm)
U6 = IC TRANSCEIVER FULL 2/2 16SOIC 3.90mm Width: 2/2 Transceiver Full RS232 3.3Volts 16-SOIC (0.154", 3.90mm Width); Data Rate: 250kbps; Voltage - Supply: 3V ~ 5.5V; Digi-Key Part Number: 3351-UM3232EESETR-ND; Value: UM3232EESE; Number of Drivers/Receivers: 2/2; Operating Temperature: -40°C ~ 85°C (TA); Package / Case: 16-SOIC (0.154", 3.90mm Width)

## Sheet 10_SES.SchDoc
size A3
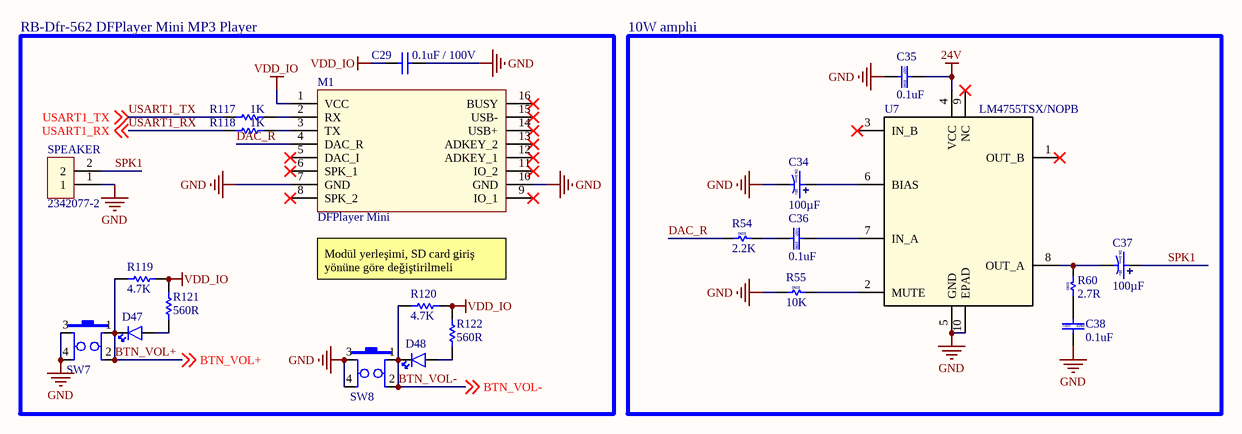
[diagram p9: 10_SES.SchDoc]

### Parts
C29  0.1uF / 100V  [603C]
C34  100µF  [CAPALP_6.6x6.6mm]
C35  0.1uF  [603C]
C36  0.1uF  [603C]
C37  100µF  [CAPALP_6.6x6.6mm]
C38  0.1uF  [603C]
D47  led_green  [805LED]  (value not drawn)
D48  led_green  [805LED]  (value not drawn)
M1  DFPlayer Mini  [DFPLAYER MINI]
R54  2.2K  [603R]
R55  10K  [603R]
R60  2.7R  [603R]
R117  1K  [603R]
R118  1K  [603R]
R119  4.7K  [603R]
R120  4.7K  [603R]
R121  560R  [603R]
R122  560R  [603R]
SPEAKER  2342077-2  [TERM BLOCK HDR 2POS 90DEG PITCH 3.81MM]
SW7  switch tactile  [SW_TACTILE_6X6mm SMT]  (value not drawn)
SW8  switch tactile  [SW_TACTILE_6X6mm SMT]  (value not drawn)
U7  LM4755TSX/NOPB  [TO-263-10 (9 Leads + Tab)]

### Blocks framed on the sheet
RB-Dfr-562 DFPlayer Mini MP3 Player: C29 D47 D48 M1 R117-R122 SPEAKER SW7 SW8
10W amphi: C34-C38 R54 R55 R60 U7

### Nets
24V: C35.2 U7.4(VCC)
GND: C29.2 C34.2 C35.1 C38.1 M1.7(GND) M1.10(GND) R55.1 SPEAKER.1 SW7.3 SW7.4 SW8.3 SW8.4 U7.5(GND) U7.10(EPAD)
VDD_IO: C29.1 M1.1(VCC) R119.2 R120.2 R121.2 R122.2  [project net 5V]
BTN_VOL+: D47.2(K) R119.1 SW7.1 SW7.2 ; off-sheet BTN_VOL+
BTN_VOL-: D48.2(K) R120.1 SW8.1 SW8.2 ; off-sheet BTN_VOL-
DAC_R: M1.4(DAC_R) R54.1
SPK1: C37.1 SPEAKER.2
USART1_RX: R118.1 ; off-sheet USART1_RX
USART1_TX: R117.1 ; off-sheet USART1_TX
NetC34_1: C34.1 U7.6(BIAS)
NetC36_1: C36.1 R54.2
NetC36_2: C36.2 U7.7(IN_A)
NetC37_2: C37.2 R60.2 U7.8(OUT_A)
NetC38_2: C38.2 R60.1
NetD47_1: D47.1(A) R121.1
NetD48_1: D48.1(A) R122.1
NetM1_2: M1.2(RX) R117.2
NetM1_3: M1.3(TX) R118.2
NetR55_2: R55.2 U7.2(MUTE)

Not connected (* = marked no-connect by the designer): M1 5(DAC_I)* 6(SPK_1)* 8(SPK_2)* 9(IO_1)* 11(IO_2)* 12(ADKEY_1)* 13(ADKEY_2)* 14(USB+)* 15(USB-)* 16(BUSY)*; U7 1(OUT_B)* 3(IN_B)* 9(NC)*

### Notes on the sheet
- Modül yerleşimi, SD card giriş yönüne göre değiştirilmeli
- (in symbol CAP CER 0.1UF 100V X7R 0603) 0603
- (in symbol CAP_ALP_100uF_35V_%20_DIA6.3mm) D6.3mm
- (in symbol RES 2.2K OHM 5% 1/10W 0603) 0603
- (in symbol RES 2.7 OHM 1% 1/10W 0603) 0603
- (in symbol RES_10K_OHM_%5_0.1W_0603) 0603

### Library data of the parts
C29 C35 C36 C38 = CAP CER 0.1UF 100V X7R 0603: 0.1 µF ±10% 100V Ceramic Capacitor X7R 0603 (1608 Metric); Manufacturer: Venkel; Manufacturer Part Number: C0603X7R101-104KNP; Digi-Key Part Number: 2679-C0603X7R101-104KNPTR-ND; Tolerance: ±10%; Voltage - Rated: 100V; Temperature Coefficient: X7R; Operating Temperature: -55°C ~ 125°C; Applications: General Purpose; Package / Case: 0603 (1608 Metric)
  C29: Value: 0.1uF / 100V
  C35 C36 C38: Value: 0.1uF
C34 C37 = CAP_ALP_100uF_35V_%20_DIA6.3mm: 100µF 35V Aluminum Electrolytic Capacitors Radial, Can - SMD 1000 Hrs @ 105°C; Manufacturer: Nichicon; Manufacturer Part Number: UWT1V101MCL1GS; Ripple Current: 84mA @ 120Hz / 126mA @ 10kHz; Surface Mount Land Size: 0.260" L x 0.260" W (6.60mm x 6.60mm); Tolerance: ±20%; value: 100µF; Digi-Key Part Number: 493-2203-2-ND; Package / Case: Radial, Can - SMD (R 6.6mm); ESR (Equivalent Series Resistance): -; Operating Temperature: -55°C ~ 105°C; Voltage - Rated: 35V; Size / Dimension: 0.248" Dia (6.30mm); Height - Seated (Max): 0.303" (7.70mm)
D47 D48 = LED_GREEN_0805: LED 2X1.2MM 570NM GN WTR CLR SMD; Millicandela Rating: 50mcd; Voltage - Forward (Vf): 2.1V; value: led_green; Digi-Key Part Number: 754-1127-1-ND; Case: 0805; Viewing Angle: -
M1 = MP3 PLAYER MODULE DFPlayer Mini: DFPLayer Mini module is a serial MP3 module provides the perfect integrated MP3, WMV hardware decoding.; Value: DFPlayer Mini
R54 = RES 2.2K OHM 5% 1/10W 0603: 2.2 kOhms ±5% 0.1W, 1/10W Chip Resistor 0603 (1608 Metric) Automotive AEC-Q200 Thick Film; Temperature Coefficient: ±200ppm/°C; Value: 2.2K; Digi-Key Part Number: RMCF0603JT2K20TR-ND; Tolerance: ±5%; Power (Watts): 0.1W, 1/10W; Operating Temperature: -55°C ~ 155°C; Package / Case: 0603 (1608 Metric)
R55 = RES_10K_OHM_%5_0.1W_0603: 10 kOhms ±5% 0.1W, 1/10W Chip Resistor 0603 (1608 Metric) Moisture Resistant Thick Film; Manufacturer: Yageo; Manufacturer Part Number: RC0603JR-0710KL; Temperature Coefficient: ±100ppm/°C; Value: 10K; Digi-Key Part Number: 311-10KGRTR-ND; Tolerance: ±5%; Power (Watts): 0.1W, 1/10W; Composition: Thick Film; Operating Temperature: -55°C ~ 155°C; Package / Case: 0603 (1608 Metric); Size / Dimension: 0.063" L x 0.032" W (1.60mm x 0.80mm); Height - Seated (Max): 0.022" (0.55mm); Features: Moisture Resistant
R60 = RES 2.7 OHM 1% 1/10W 0603: 2.7 Ohms ±1% 0.1W, 1/10W Chip Resistor 0603 (1608 Metric) Automotive AEC-Q200 Thick Film; Manufacturer: Stackpole Electronics Inc; Manufacturer Part Number: RMCF0603FT2R70; Temperature Coefficient: ±200ppm/°C; Value: 2.7R; Digi-Key Part Number: RMCF0603FT2R70CT-ND; Tolerance: ±1%; Power (Watts): 0.1W, 1/10W; Composition: Thick Film; Operating Temperature: -55°C ~ 155°C; Package / Case: 0603 (1608 Metric); Size / Dimension: 0.063" L x 0.032" W (1.60mm x 0.80mm); Height - Seated (Max): 0.022" (0.55mm); Features: Automotive AEC-Q200
R117 R118 = RES_1K_OHM_%5_0.1W_0603: 1 kOhms ±5% 0.1W, 1/10W Chip Resistor 0603 (1608 Metric) Moisture Resistant Thick Film; Manufacturer: Yageo; Manufacturer Part Number: RC0603JR-071KL; Temperature Coefficient: ±100ppm/°C; Value: 1K; Digi-Key Part Number: 311-1.0KGRTR-ND; Tolerance: ±5%; Power (Watts): 0.1W, 1/10W; Composition: Thick Film; Operating Temperature: -55°C ~ 155°C; Package / Case: 0603 (1608 Metric); Size / Dimension: 0.063" L x 0.032" W (1.60mm x 0.80mm); Height - Seated (Max): 0.022" (0.55mm); Features: Moisture Resistant
R119 R120 = RES_4.7K_OHM_%5_0.1W_0603: 4.7 kOhms ±5% 0.1W, 1/10W Chip Resistor 0603 (1608 Metric) Moisture Resistant Thick Film; Manufacturer: Yageo; Manufacturer Part Number: RC0603JR-074K7L; Temperature Coefficient: ±100ppm/°C; Value: 4.7K; Digi-Key Part Number: 311-4.7KGRTR-ND; Tolerance: ±5%; Power (Watts): 0.1W, 1/10W; Composition: Thick Film; Operating Temperature: -55°C ~ 155°C; Package / Case: 0603 (1608 Metric); Size / Dimension: 0.063" L x 0.032" W (1.60mm x 0.80mm); Height - Seated (Max): 0.022" (0.55mm); Features: Moisture Resistant
R121 R122 = RES_560_OHM_%5_0.1W_0603: 560 Ohms ±5% 0.1W, 1/10W Chip Resistor 0603 (1608 Metric) Moisture Resistant Thick Film; Manufacturer: Yageo; Manufacturer Part Number: RC0603JR-07560RL; Temperature Coefficient: ±100ppm/°C; Value: 560R; Digi-Key Part Number: 311-560GRCT-ND; Tolerance: ±5%; Power (Watts): 0.1W, 1/10W; Composition: Thick Film; Operating Temperature: -55°C ~ 155°C; Package / Case: 0603 (1608 Metric); Size / Dimension: 0.063" L x 0.032" W (1.60mm x 0.80mm); Height - Seated (Max): 0.022" (0.55mm); Features: Moisture Resistant
SPEAKER = TERM BLOCK HDR 2POS 90DEG 3.81MM: 2 Position Terminal Block Header, Male Pins, Shrouded (4 Side) 0.150" (3.81mm) 90°, Right Angle - Through Hole; Manufacturer: TE Connectivity AMP Connectors; Contact Tail Length: 0.075" (1.90mm); Digi-Key Part Number: A145321-ND; Value: 2342077-2; Pitch: 0.150" (3.81mm); Header Orientation: 90°, Right Angle; Insulation Height: 0.285" (7.25mm)
SW7 SW8 = SW_TACTILE_6x6x4.3mm SMT: Tactile Switch SPST-NO Top Actuated Surface Mount; Switch Function: Off-Mom; Value: switch tactile; Digi-Key Part Number: CKN9112TR-ND; case: 6.00mm x 6.00mm_H4.30mm
U7 = IC AMP CLASS AB STER 11W TO263-9 LM4755TSXNOPB: Amplifier IC 2-Channel (Stereo) Class AB DDPAK/TO-263-9; Manufacturer: Texas Instruments; Voltage - Supply: 9V ~ 32V; Max Output Power x Channels @ Load: 11W x 2 @ 4Ohm; Package / Case: TO-263-10 (9 Leads + Tab); Operating Temperature: -20°C ~ 80°C; Features: Mute, Short-Circuit and Thermal Protection; Output Type: 2-Channel (Stereo); Type: Class AB; Value: LM4755TSX/NOPB; DigiKey Part Number: 296-46304-1-ND

## Nets that join several sheets
5V: 01_POWER (C3.2 L1.2 R1.2), 02_CPU (18 pins), 03_PHOTOELECTRIC_SENSOR (22 pins), 04_GIRIS_CIKIS_EMG_BUTTONS (6 pins), 07_MOTOR_DRIVER_INTERFACE (6 pins), 08_SLAVE_CARD_CONNECTOR_RJ45 (R105.2 R106.2 R109.2 R112.2), 09_RS232 (C24.2 U6.16), 10_SES (6 pins)
12V: 01_POWER (7 pins), 06_LED_OUTPUTS (HDR1.3 J1.1 SRT_LED_2.4)
24V: 01_POWER (8 pins), 03_PHOTOELECTRIC_SENSOR (9 pins), 04_GIRIS_CIKIS_EMG_BUTTONS (R51.1 R57.1 R62.1), 06_LED_OUTPUTS (11 pins), 07_MOTOR_DRIVER_INTERFACE (R88.1 R91.1 U5.1 U5.2), 08_SLAVE_CARD_CONNECTOR_RJ45 (R107.1 R110.1), 10_SES (C35.2 U7.4)
GND: 01_POWER (19 pins), 02_CPU (17 pins), 03_PHOTOELECTRIC_SENSOR (42 pins), 04_GIRIS_CIKIS_EMG_BUTTONS (20 pins), 05_FEEDBACK_OUTPUTS (6 pins), 06_LED_OUTPUTS (9 pins), 07_MOTOR_DRIVER_INTERFACE (18 pins), 08_SLAVE_CARD_CONNECTOR_RJ45 (12 pins), 09_RS232 (6 pins), 10_SES (14 pins)
BTN_ACIL: 02_CPU (U2.13), 04_GIRIS_CIKIS_EMG_BUTTONS (5 pins)
BTN_CIKIS: 02_CPU (U2.9), 04_GIRIS_CIKIS_EMG_BUTTONS (5 pins)
BTN_GIRIS: 02_CPU (U2.8), 04_GIRIS_CIKIS_EMG_BUTTONS (5 pins)
BTN_VOL+: 02_CPU (U2.14), 10_SES (D47.2 R119.1 SW7.1 SW7.2)
BTN_VOL-: 02_CPU (U2.15), 10_SES (D48.2 R120.1 SW8.1 SW8.2)
DIP_SW1: 02_CPU (U2.28), 04_GIRIS_CIKIS_EMG_BUTTONS (DS1.1B)
DIP_SW2: 02_CPU (U2.29), 04_GIRIS_CIKIS_EMG_BUTTONS (DS1.2B)
DIP_SW3: 02_CPU (U2.31), 04_GIRIS_CIKIS_EMG_BUTTONS (DS1.3B)
DIP_SW4: 02_CPU (U2.32), 04_GIRIS_CIKIS_EMG_BUTTONS (DS1.4B)
DIP_SW5: 02_CPU (U2.37), 04_GIRIS_CIKIS_EMG_BUTTONS (DS1.5B)
DIP_SW6: 02_CPU (U2.38), 04_GIRIS_CIKIS_EMG_BUTTONS (DS1.6B)
DIP_SW7: 02_CPU (U2.41), 04_GIRIS_CIKIS_EMG_BUTTONS (DS1.7B)
DIP_SW8: 02_CPU (U2.42), 04_GIRIS_CIKIS_EMG_BUTTONS (DS1.8B)
ESENS_M1: 02_CPU (U2.48), 03_PHOTOELECTRIC_SENSOR (D19.2 O8.4 R34.1)
ESENS_M2: 02_CPU (U2.49), 03_PHOTOELECTRIC_SENSOR (D21.2 O9.4 R35.1)
ESENS_S1: 02_CPU (U2.72), 03_PHOTOELECTRIC_SENSOR (D23.2 O10.4 R42.1)
ESENS_S2: 02_CPU (U2.73), 03_PHOTOELECTRIC_SENSOR (D25.2 O11.4 R43.1)
ESENS_SIN1: 03_PHOTOELECTRIC_SENSOR (R44.1), 08_SLAVE_CARD_CONNECTOR_RJ45 (SLV_CON1.5)
ESENS_SIN2: 03_PHOTOELECTRIC_SENSOR (R46.1), 08_SLAVE_CARD_CONNECTOR_RJ45 (SLV_CON1.3)
FB_ACIL: 02_CPU (U2.105), 05_FEEDBACK_OUTPUTS (R70.1 R71.2)
FB_CIKIS: 02_CPU (U2.106), 05_FEEDBACK_OUTPUTS (R68.1 R69.2)
FB_GIRIS: 02_CPU (U2.124), 05_FEEDBACK_OUTPUTS (R66.1 R67.2)
M_LED_GOS: 02_CPU (U2.1), 06_LED_OUTPUTS (U3.7)
M_LED_GOS2: 02_CPU (U2.16), 06_LED_OUTPUTS (R130.2)
M_SRT_LED1_BLUE: 02_CPU (U2.5), 06_LED_OUTPUTS (U3.3)
M_SRT_LED1_GREEN: 02_CPU (U2.6), 06_LED_OUTPUTS (U3.2)
M_SRT_LED1_RED: 02_CPU (U2.7), 06_LED_OUTPUTS (U3.1)
M_SRT_LED2_BLUE: 02_CPU (U2.2), 06_LED_OUTPUTS (U3.6)
M_SRT_LED2_GREEN: 02_CPU (U2.3), 06_LED_OUTPUTS (U3.5)
M_SRT_LED2_RED: 02_CPU (U2.4), 06_LED_OUTPUTS (U3.4)
MDM_ALARM_IN: 02_CPU (U2.70), 07_MOTOR_DRIVER_INTERFACE (D37.2 O15.4 R90.1)
MDM_ALARM_RST: 02_CPU (U2.50), 07_MOTOR_DRIVER_INTERFACE (R83.2)
MDM_CURRENT: 02_CPU (U2.118), 07_MOTOR_DRIVER_INTERFACE (C22.2 R94.2)
MDM_FWD: 02_CPU (U2.51), 07_MOTOR_DRIVER_INTERFACE (R79.2)
MDM_PWM_OUT: 02_CPU (U2.55), 07_MOTOR_DRIVER_INTERFACE (R78.2)
MDM_REV: 02_CPU (U2.54), 07_MOTOR_DRIVER_INTERFACE (R82.2)
MDM_SPEED_IN: 02_CPU (U2.69), 07_MOTOR_DRIVER_INTERFACE (D38.2 O16.4 R93.1)
MDS_ALARM_IN: 02_CPU (U2.71), 08_SLAVE_CARD_CONNECTOR_RJ45 (D42.2 O18.4 R112.1)
MDS_ALARM_RST: 02_CPU (U2.94), 08_SLAVE_CARD_CONNECTOR_RJ45 (R103.2)
MDS_CURRENT: 02_CPU (U2.119), 08_SLAVE_CARD_CONNECTOR_RJ45 (SLV_CON2.8)
MDS_FWD: 02_CPU (U2.95), 08_SLAVE_CARD_CONNECTOR_RJ45 (R101.2)
MDS_PWM_OUT: 02_CPU (U2.102), 08_SLAVE_CARD_CONNECTOR_RJ45 (R97.2)
MDS_REV: 02_CPU (U2.96), 08_SLAVE_CARD_CONNECTOR_RJ45 (R99.2)
MDS_SPEED_IN: 02_CPU (U2.74), 08_SLAVE_CARD_CONNECTOR_RJ45 (D41.2 O17.4 R109.1)
PSENS_IN1: 02_CPU (U2.19), 03_PHOTOELECTRIC_SENSOR (D5.2 O1.4 R6.1)
PSENS_IN2: 02_CPU (U2.20), 03_PHOTOELECTRIC_SENSOR (D9.2 O3.4 R14.1)
PSENS_IN3: 02_CPU (U2.43), 03_PHOTOELECTRIC_SENSOR (D13.2 O5.4 R22.1)
PSENS_IN4: 02_CPU (U2.44), 03_PHOTOELECTRIC_SENSOR (D17.2 O7.4 R30.1)
PSENS_IN5: 02_CPU (U2.45), 03_PHOTOELECTRIC_SENSOR (D7.2 O2.4 R7.1)
PSENS_IN6: 02_CPU (U2.46), 03_PHOTOELECTRIC_SENSOR (D11.2 O4.4 R15.1)
PSENS_IN7: 02_CPU (U2.47), 03_PHOTOELECTRIC_SENSOR (D15.2 O6.4 R23.1)
S_LED_GOS: 02_CPU (U2.87), 06_LED_OUTPUTS (U4.7)
S_LED_GOS_OUT: 06_LED_OUTPUTS (Q2.3 R73.2), 08_SLAVE_CARD_CONNECTOR_RJ45 (SLV_CON2.1)
S_SRT_LED1_BLUE: 02_CPU (U2.90), 06_LED_OUTPUTS (U4.4)
S_SRT_LED1_BLUE_O: 06_LED_OUTPUTS (U4.13), 08_SLAVE_CARD_CONNECTOR_RJ45 (SLV_CON2.4)
S_SRT_LED1_GREEN: 02_CPU (U2.91), 06_LED_OUTPUTS (U4.3)
S_SRT_LED1_GREEN_O: 06_LED_OUTPUTS (U4.14), 08_SLAVE_CARD_CONNECTOR_RJ45 (SLV_CON2.5)
S_SRT_LED1_RED: 02_CPU (U2.92), 06_LED_OUTPUTS (U4.2)
S_SRT_LED1_RED_O: 06_LED_OUTPUTS (U4.15), 08_SLAVE_CARD_CONNECTOR_RJ45 (SLV_CON2.6)
S_SRT_LED2_BLUE: 02_CPU (U2.93), 06_LED_OUTPUTS (U4.1)
S_SRT_LED2_BLUE_O: 06_LED_OUTPUTS (U4.16), 08_SLAVE_CARD_CONNECTOR_RJ45 (SLV_CON2.7)
S_SRT_LED2_GREEN: 02_CPU (U2.88), 06_LED_OUTPUTS (U4.6)
S_SRT_LED2_GREEN_O: 06_LED_OUTPUTS (U4.11), 08_SLAVE_CARD_CONNECTOR_RJ45 (SLV_CON2.2)
S_SRT_LED2_RED: 02_CPU (U2.89), 06_LED_OUTPUTS (U4.5)
S_SRT_LED2_RED_O: 06_LED_OUTPUTS (U4.12), 08_SLAVE_CARD_CONNECTOR_RJ45 (SLV_CON2.3)
SRT_LED_DOUT: 02_CPU (U2.18), 06_LED_OUTPUTS (J2.2)
USART0_RX: 02_CPU (U2.126), 09_RS232 (R116.1)
USART0_TX: 02_CPU (U2.125), 09_RS232 (R114.2)
USART1_RX: 02_CPU (U2.128), 10_SES (R118.1)
USART1_TX: 02_CPU (U2.127), 10_SES (R117.1)